# EAGLE design Schematic (EAGLE 9.2.1)
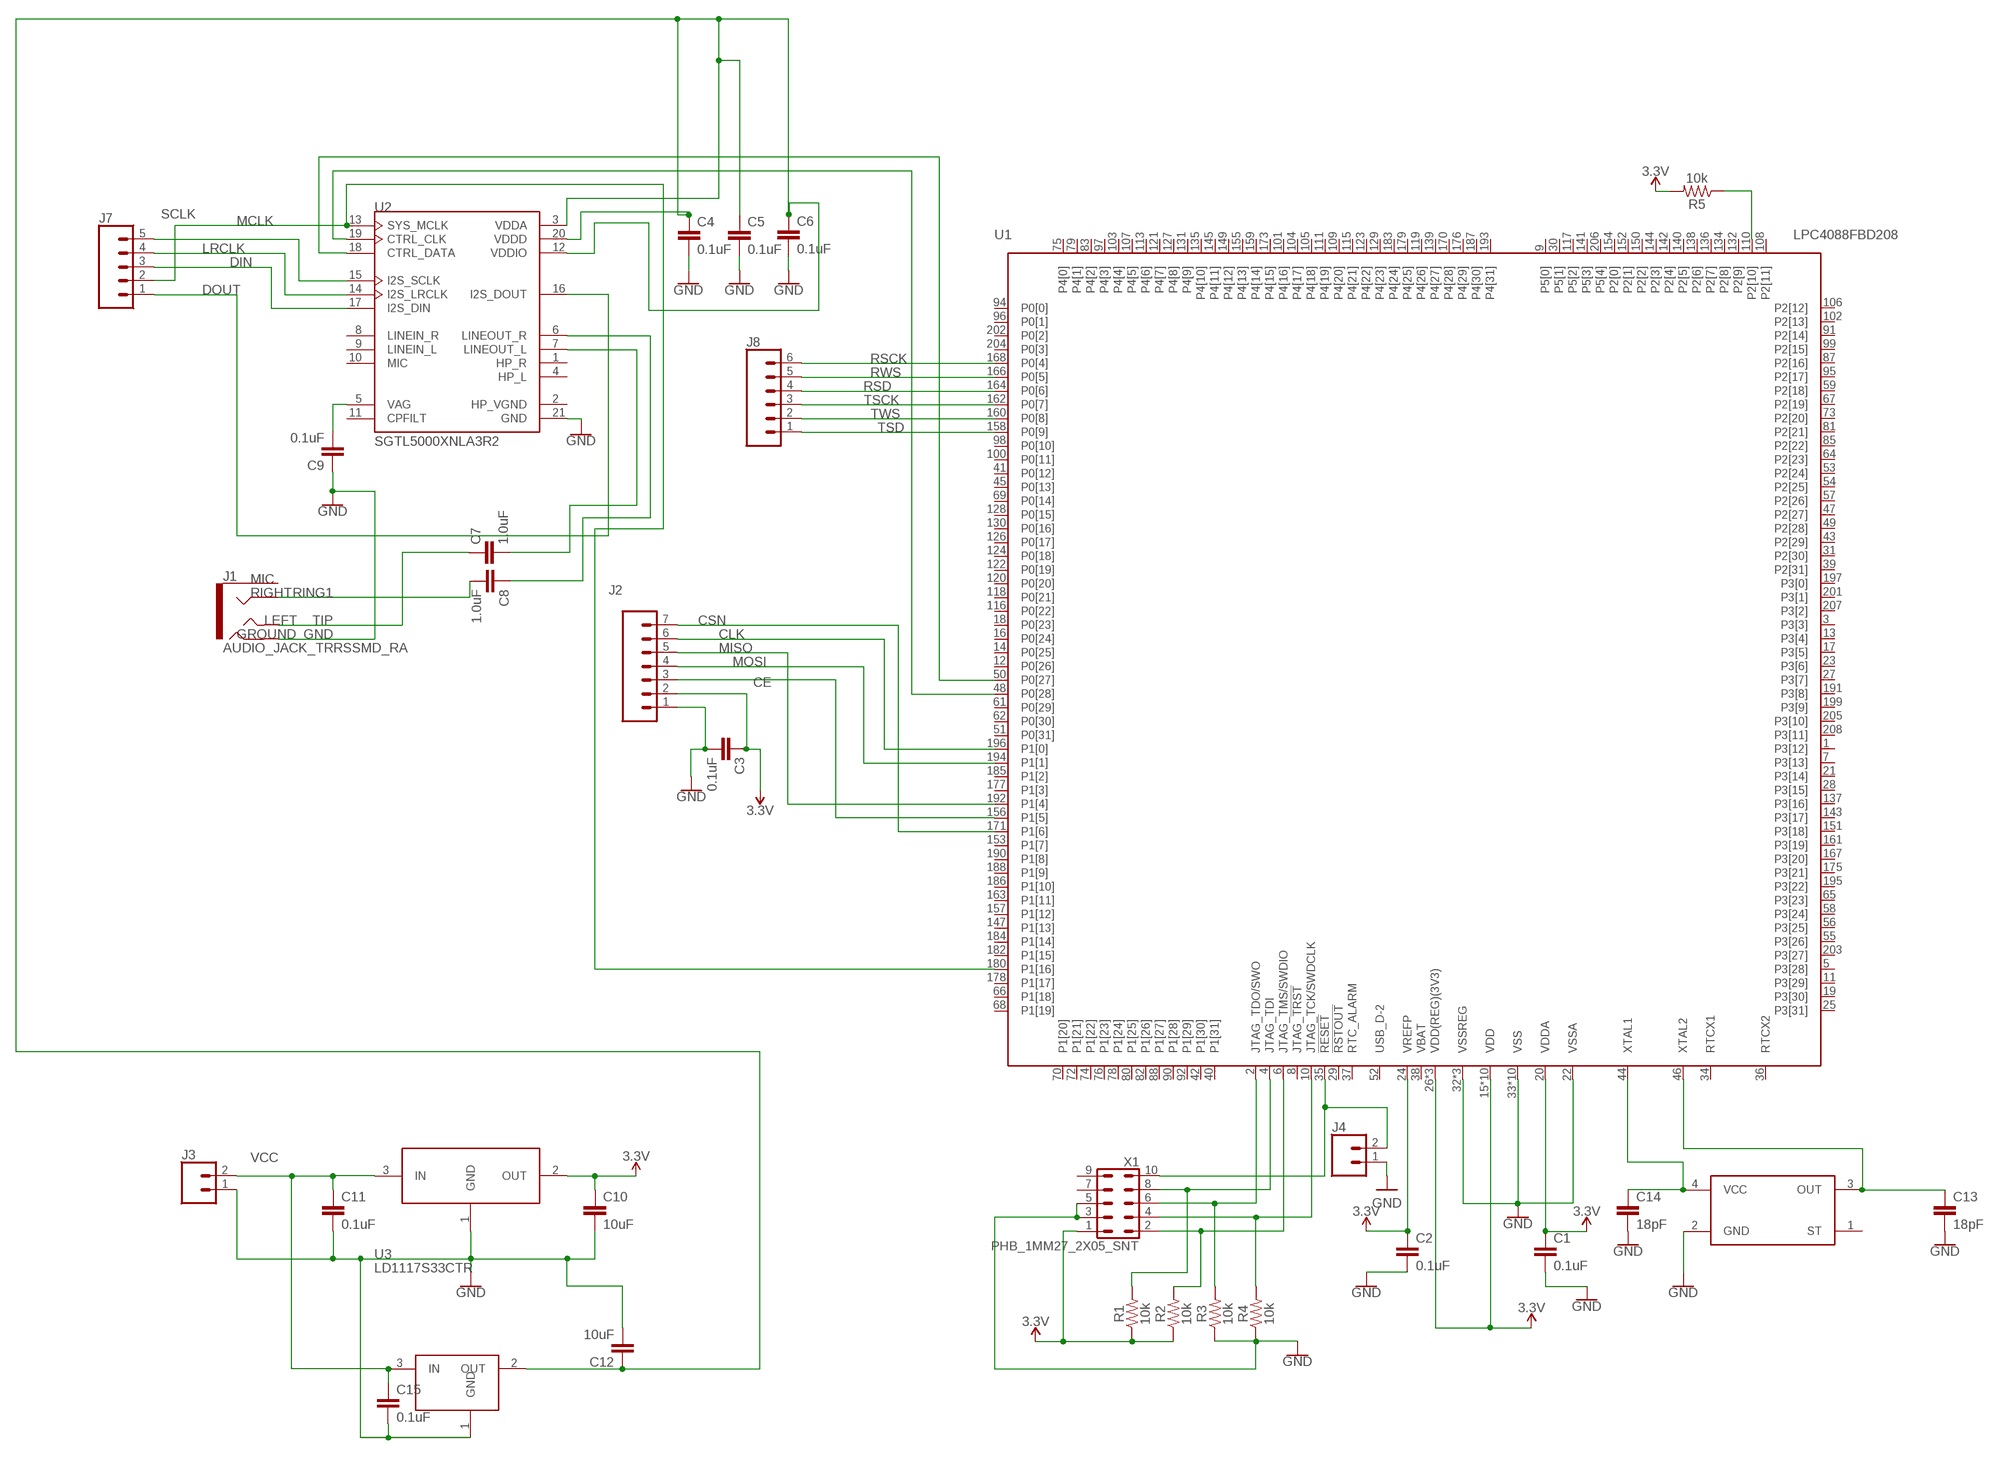
[diagram p0: schematic, sheet 1]

## Parts
C1  0.1uF  0.1UF-0603-25V-(+80/-20%)  [0603]
C2  0.1uF  0.1UF-0603-25V-(+80/-20%)  [0603]
C3  0.1uF  0.1UF-0603-25V-(+80/-20%)  [0603]
C4  0.1uF  0.1UF-0402-16V-10%  [0402]
C5  0.1uF  0.1UF-0402-16V-10%  [0402]
C6  0.1uF  0.1UF-0402-16V-10%  [0402]
C7  1.0uF  1.0UF-0402-16V-10%  [0402]
C8  1.0uF  1.0UF-0402-16V-10%  [0402]
C9  0.1uF  0.1UF-0402-16V-10%  [0402]
C10  10uF  10UF-0603-6.3V-20%  [0603]
C11  0.1uF  0.1UF-0603-25V-(+80/-20%)  [0603]
C12  10uF  10UF-0603-6.3V-20%  [0603]
C13  18pF  18PF-0603-50V-5%  [0603]
C14  18pF  18PF-0603-50V-5%  [0603]
C15  0.1uF  0.1UF-0603-25V-(+80/-20%)  [0603]
J1  AUDIO_JACK_TRRSSMD_RA  [AUDIO_JACK_3.5MM_TRRS_SMD_RA]
J2  CONN_07  [1X07]
J3  CONN_02  [1X02]
J4  CONN_02  [1X02]
J7  CONN_05  [1X05]
J8  CONN_06SILK_FEMALE_PTH  [1X06]
R1  10k  33OHM-0603-1/10W-1%  [0603]
R2  10k  33OHM-0603-1/10W-1%  [0603]
R3  10k  33OHM-0603-1/10W-1%  [0603]
R4  10k  33OHM-0603-1/10W-1%  [0603]
R5  10k  33OHM-0603-1/10W-1%  [0603]
U1  LPC4088FBD208  [SOT459-1]
U2  SGTL5000XNLA3R2  [QFN40P300X300X60-21N]
U3  LD1117S33CTR  [SOT223]
U$1  SOT230P700X180-4N  [SOT230P700X180-4N]
U$2  XTAL_FA-238_25.0000MB-C3  [XTAL_FA-238_25.0000MB-C3]
X1  PHB_1MM27_2X05_SNT  [PHB_1MM27_2X05_SNT]

## Nets
3.3V: C1.1 C2.1 C3.1 C10.1 J2.2 R1.1 R2.1 R5.2 U1.15(VDD) U1.20(VDDA) U1.24(VREFP) U1.26(VDD(REG)(3V3)) U1.60(VDD) U1.71(VDD) U1.86(VDD(REG)(3V3)) U1.89(VDD) U1.112(VDD) U1.125(VDD) U1.146(VDD) U1.165(VDD) U1.174(VDD(REG)(3V3)) U1.181(VDD) U1.198(VDD) U3.2(OUT) X1.1
CE: J2.3 U1.156(P1[5])
CLK: J2.6 U1.196(P1[0])
CSN: J2.7 U1.171(P1[6])
DIN: J7.3 U2.17(I2S_DIN)
DOUT: J7.1 U2.16(I2S_DOUT)
GND: C1.2 C2.2 C3.2 C4.2 C5.2 C6.2 C9.1 C10.2 C11.2 C12.2 C13.2 C14.2 C15.2 J1.RING2 J2.1 J3.1 J4.1 R3.1 R4.1 U1.22(VSSA) U1.32(VSSREG) U1.33(VSS) U1.63(VSS) U1.77(VSS) U1.84(VSSREG) U1.93(VSS) U1.114(VSS) U1.133(VSS) U1.148(VSS) U1.169(VSS) U1.172(VSSREG) U1.189(VSS) U1.200(VSS) U2.21(GND) U3.1(GND) U$1.1(GND) U$2.2(GND) X1.3 X1.5
LRCLK: J7.4 U2.14(I2S_LRCLK)
MCLK: J7.2 U1.180(P1[16]) U2.13(SYS_MCLK)
MISO: J2.5 U1.192(P1[4])
MOSI: J2.4 U1.194(P1[1])
N$1: C8.1 U2.6(LINEOUT_R)
N$2: C7.2 U2.7(LINEOUT_L)
N$3: C14.1 U1.44(XTAL1) U$2.4(VCC)
N$6: U1.48(P0[28]) U2.19(CTRL_CLK)
N$7: U1.50(P0[27]) U2.18(CTRL_DATA)
N$9: R3.2 U1.2(JTAG_TDO/SWO) X1.6
N$12: R1.2 U1.4(JTAG_TDI) X1.8
N$13: R2.2 U1.6(JTAG_TMS/SWDIO) X1.2
N$14: R4.2 U1.10(JTAG_TCK/SWDCLK) X1.4
N$15: C9.2 U2.5(VAG)
N$16: R5.1 U1.110(P2[10])
N$18: J4.2 U1.35(!RESET!) X1.10
N$19: C13.1 U1.46(XTAL2) U$2.3(OUT)
N$20: C4.1 C5.1 C6.1 C12.1 U2.3(VDDA) U2.12(VDDIO) U2.20(VDDD) U$1.2(OUT)
RING1: C8.2 J1.RING1
RSCK: J8.6 U1.168(P0[4])
RSD: J8.4 U1.164(P0[6])
RWS: J8.5 U1.166(P0[5])
SCLK: J7.5 U2.15(I2S_SCLK)
TIP: C7.1 J1.TIP
TSCK: J8.3 U1.162(P0[7])
TSD: J8.1 U1.158(P0[9])
TWS: J8.2 U1.160(P0[8])
VCC: C11.1 C15.1 J3.2 U3.3(IN) U$1.3(IN)
Unconnected: J1.EARTH U1.1(P3[12]) U1.3(P3[3]) U1.5(P3[28]) U1.7(P3[13]) U1.8(JTAG_!TRST) U1.9(P5[0]) U1.11(P3[29]) U1.12(P0[26]) U1.13(P3[4]) U1.14(P0[25]) U1.16(P0[24]) U1.17(P3[5]) U1.18(P0[23]) U1.19(P3[30]) U1.21(P3[14]) U1.23(P3[6]) U1.25(P3[31]) U1.27(P3[7]) U1.28(P3[15]) U1.29(!RSTOUT!) U1.30(P5[1]) U1.31(P2[30]) U1.34(RTCX1) U1.36(RTCX2) U1.37(RTC_ALARM) U1.39(P2[31]) U1.40(P1[31]) U1.41(P0[12]) U1.42(P1[30]) U1.43(P2[29]) U1.45(P0[13]) U1.47(P2[27]) U1.49(P2[28]) U1.51(P0[31]) U1.52(USB_D-2) U1.53(P2[24]) U1.54(P2[25]) U1.55(P3[26]) U1.56(P3[25]) U1.57(P2[26]) U1.58(P3[24]) U1.59(P2[18]) U1.61(P0[29]) U1.62(P0[30]) U1.64(P2[23]) U1.65(P3[23]) U1.66(P1[18]) U1.67(P2[19]) U1.68(P1[19]) U1.69(P0[14]) U1.70(P1[20]) U1.72(P1[21]) U1.73(P2[20]) U1.74(P1[22]) U1.75(P4[0]) U1.76(P1[23]) U1.78(P1[24]) U1.79(P4[1]) U1.80(P1[25]) U1.81(P2[21]) U1.82(P1[26]) U1.83(P4[2]) U1.85(P2[22]) U1.87(P2[16]) U1.88(P1[27]) U1.90(P1[28]) U1.91(P2[14]) U1.92(P1[29]) U1.94(P0[0]) U1.95(P2[17]) U1.96(P0[1]) U1.97(P4[3]) U1.98(P0[10]) U1.99(P2[15]) U1.100(P0[11]) U1.101(P4[16]) U1.102(P2[13]) U1.103(P4[4]) U1.104(P4[17]) U1.105(P4[18]) U1.106(P2[12]) U1.107(P4[5]) U1.108(P2[11]) U1.109(P4[20]) U1.111(P4[19]) U1.113(P4[6]) U1.115(P4[21]) U1.116(P0[22]) U1.117(P5[2]) U1.118(P0[21]) U1.119(P4[26]) U1.120(P0[20]) U1.121(P4[7]) U1.122(P0[19]) U1.123(P4[22]) U1.124(P0[18]) U1.126(P0[17]) U1.127(P4[8]) U1.128(P0[15]) U1.129(P4[23]) U1.130(P0[16]) U1.131(P4[9]) U1.132(P2[9]) U1.134(P2[8]) U1.135(P4[10]) U1.136(P2[7]) U1.137(P3[16]) U1.138(P2[6]) U1.139(P4[27]) U1.140(P2[5]) U1.141(P5[3]) U1.142(P2[4]) U1.143(P3[17]) U1.144(P2[3]) U1.145(P4[11]) U1.147(P1[13]) U1.149(P4[12]) U1.150(P2[2]) U1.151(P3[18]) U1.152(P2[1]) U1.153(P1[7]) U1.154(P2[0]) U1.155(P4[13]) U1.157(P1[12]) U1.159(P4[14]) U1.161(P3[19]) U1.163(P1[11]) U1.167(P3[20]) U1.170(P4[28]) U1.173(P4[15]) U1.175(P3[21]) U1.176(P4[29]) U1.177(P1[3]) U1.178(P1[17]) U1.179(P4[25]) U1.182(P1[15]) U1.183(P4[24]) U1.184(P1[14]) U1.185(P1[2]) U1.186(P1[10]) U1.187(P4[30]) U1.188(P1[9]) U1.190(P1[8]) U1.191(P3[8]) U1.193(P4[31]) U1.195(P3[22]) U1.197(P3[0]) U1.199(P3[9]) U1.201(P3[1]) U1.202(P0[2]) U1.203(P3[27]) U1.204(P0[3]) U1.205(P3[10]) U1.206(P5[4]) U1.207(P3[2]) U1.208(P3[11]) U2.1(HP_R) U2.4(HP_L) U2.8(LINEIN_R) U2.9(LINEIN_L) U2.10(MIC) U2.11(CPFILT) U$2.1(ST) X1.7 X1.9

## Notes on the sheet
- MIC
- RIGHT
- LEFT
- GROUND

## Power pins joined to a net without a drawn wire
HP_VGND: U2.2(HP_VGND)
VBAT: U1.38(VBAT)

## Library data of the parts
C1 C2 C11 C15 = SparkFun-Capacitors:0.1UF: 0.1µF ceramic capacitors A capacitor is a passive two-terminal electrical component used to store electrical energy temporarily in an electric field.; PROD_ID: CAP-00810
C3 = Homework1:0.1UF: 0.1µF ceramic capacitors A capacitor is a passive two-terminal electrical component used to store electrical energy temporarily in an electric field.; PROD_ID: CAP-00810
C4-C6 C9 = Homework1:0.1UF: 0.1µF ceramic capacitors A capacitor is a passive two-terminal electrical component used to store electrical energy temporarily in an electric field.; PROD_ID: CAP-12416
C7 C8 = Homework1:1.0UF: 1µF ceramic capacitors A capacitor is a passive two-terminal electrical component used to store electrical energy temporarily in an electric field.; PROD_ID: CAP-12417
C10 C12 = SparkFun-Capacitors:10UF: 10.0µF ceramic capacitors A capacitor is a passive two-terminal electrical component used to store electrical energy temporarily in an electric field.; PROD_ID: CAP-11015
C13 C14 = SparkFun-Capacitors:18PF: 18pF ceramic capacitors A capacitor is a passive two-terminal electrical component used to store electrical energy temporarily in an electric field.; PROD_ID: CAP-08267
J1 = SparkFun-Connectors:AUDIO_JACK_TRRS: Audio Jack - 3.5mm TRRS (SMD) This is a 3.5mm TRRS SMD audio jack. TRRS connectors are the audio-style connectors that you see on some phones, MP3 players and development boards. TRRS stands for “tip, ring, ring, sleeve,” which reflects that this has three conductors and a ground. SparkFun Products: Audio Jack <https://www.sparkfun.com/products/12639> mbed Starter Kit <https://www.sparkfun.com/products/12968> SparkFun TRRS 3.5mm Jack Breakout <https://www.sparkfun.com/products/11570>; PROD_ID: CONN-10676; SF_ID: PRT-12639
J2 = SparkFun-Connectors:CONN_07: Multi connection point. Often used as Generic Header-pin footprint for 0.1 inch spaced/style header connections On any of the 0.1 inch spaced packages, you can populate with these: Break Away Headers - Straight <https://www.sparkfun.com/products/116> (PRT-00116) Break Away Male Headers - Right Angle <https://www.sparkfun.com/products/553> (PRT-00553) Female Headers <https://www.sparkfun.com/products/115> (PRT-00115) Break Away Headers - Machine Pin <https://www.sparkfun.com/products/117> (PRT-00117) Break Away Female Headers - Swiss Machine Pin <https://www.sparkfun.com/products/743> (PRT-00743) For SCREWTERMINALS and SPRING TERMINALS visit here: Screw Terimnals on SparkFun.com <https://www.sparkfun.com/search/results?term=Screw+Terminals> (5mm/3.5mm/2.54mm spacing) This device is also useful as a general connection point to wire up your design to another part of your project. Our various solder wires solder well into these plated through hole pads. Hook-Up Wire - Assortment (Stranded, 22 AWG) <https://www.sparkfun.com/products/11375> (PRT-11375) Hook-Up Wire - Assortment (Solid Core, 22 AWG) <https://www.sparkfun.com/products/11367> (PRT-11367) View the entire wire category on our website here <https://www.sparkfun.com/categories/141> Special notes: Molex polarized connector foot print use with SKU : PRT-08231 with associated crimp pins and housings. 1MM SMD Version SKU: PRT-10208 NOTES ON THE VARIANTS LOCK and LOCK_LONGPADS... This footprint was designed to help hold the alignment of a through-hole component (i.e. 6-pin header) while soldering it into place. You may notice that each hole has been shifted either up or down by 0.005 of an inch from it's more standard position (which is a perfectly straight line). This slight alteration caused the pins (the squares in the middle) to touch the edges of the holes. Because they are alternating, it causes a "brace" to hold the component in place. 0.005 has proven to be the perfect amount of "off-center" position when using our standard breakaway headers. Although looks a little odd when you look at the bare footprint, once you have a header in there, the alteration is very hard to notice. Also,if you push a header all the way into place, it is covered up entirely on the bottom side.
J3 J4 = SparkFun-Connectors:CONN_02: Multi connection point. Often used as Generic Header-pin footprint for 0.1 inch spaced/style header connections On any of the 0.1 inch spaced packages, you can populate with these: Break Away Headers - Straight <https://www.sparkfun.com/products/116> (PRT-00116) Break Away Male Headers - Right Angle <https://www.sparkfun.com/products/553> (PRT-00553) Female Headers <https://www.sparkfun.com/products/115> (PRT-00115) Break Away Headers - Machine Pin <https://www.sparkfun.com/products/117> (PRT-00117) Break Away Female Headers - Swiss Machine Pin <https://www.sparkfun.com/products/743> (PRT-00743) For SCREWTERMINALS and SPRING TERMINALS visit here: Screw Terimnals on SparkFun.com <https://www.sparkfun.com/search/results?term=Screw+Terminals> (5mm/3.5mm/2.54mm spacing) This device is also useful as a general connection point to wire up your design to another part of your project. Our various solder wires solder well into these plated through hole pads. Hook-Up Wire - Assortment (Stranded, 22 AWG) <https://www.sparkfun.com/products/11375> (PRT-11375) Hook-Up Wire - Assortment (Solid Core, 22 AWG) <https://www.sparkfun.com/products/11367> (PRT-11367) View the entire wire category on our website here <https://www.sparkfun.com/categories/141> Special notes: Molex polarized connector foot print use with: PRT-08233 with associated crimp pins and housings. 2.54_SCREWTERM for use with PRT-10571. 3.5mm Screw Terminal footprints for PRT-08084 5mm Screw Terminal footprints for use with PRT-08432
J7 = SparkFun-Connectors:CONN_05: Multi connection point. Often used as Generic Header-pin footprint for 0.1 inch spaced/style header connections On any of the 0.1 inch spaced packages, you can populate with these: Break Away Headers - Straight <https://www.sparkfun.com/products/116> (PRT-00116) Break Away Male Headers - Right Angle <https://www.sparkfun.com/products/553> (PRT-00553) Female Headers <https://www.sparkfun.com/products/115> (PRT-00115) Break Away Headers - Machine Pin <https://www.sparkfun.com/products/117> (PRT-00117) Break Away Female Headers - Swiss Machine Pin <https://www.sparkfun.com/products/743> (PRT-00743) For SCREWTERMINALS and SPRING TERMINALS visit here: Screw Terimnals on SparkFun.com <https://www.sparkfun.com/search/results?term=Screw+Terminals> (5mm/3.5mm/2.54mm spacing) This device is also useful as a general connection point to wire up your design to another part of your project. Our various solder wires solder well into these plated through hole pads. Hook-Up Wire - Assortment (Stranded, 22 AWG) <https://www.sparkfun.com/products/11375> (PRT-11375) Hook-Up Wire - Assortment (Solid Core, 22 AWG) <https://www.sparkfun.com/products/11367> (PRT-11367) View the entire wire category on our website here <https://www.sparkfun.com/categories/141> Special notes: Molex polarized connector foot print use with SKU : PRT-08231 with associated crimp pins and housings. 1MM SMD Version SKU: PRT-10208
J8 = SparkFun-Connectors:CONN_06: Multi connection point. Often used as Generic Header-pin footprint for 0.1 inch spaced/style header connections On any of the 0.1 inch spaced packages, you can populate with these: Break Away Headers - Straight <https://www.sparkfun.com/products/116> (PRT-00116) Break Away Male Headers - Right Angle <https://www.sparkfun.com/products/553> (PRT-00553) Female Headers <https://www.sparkfun.com/products/115> (PRT-00115) Break Away Headers - Machine Pin <https://www.sparkfun.com/products/117> (PRT-00117) Break Away Female Headers - Swiss Machine Pin <https://www.sparkfun.com/products/743> (PRT-00743) Arduino Stackable Header - 6 Pin <https://www.sparkfun.com/products/9280> (PRT-09280) For SCREWTERMINALS and SPRING TERMINALS visit here: Screw Terimnals on SparkFun.com <https://www.sparkfun.com/search/results?term=Screw+Terminals> (5mm/3.5mm/2.54mm spacing) This device is also useful as a general connection point to wire up your design to another part of your project. Our various solder wires solder well into these plated through hole pads. Hook-Up Wire - Assortment (Stranded, 22 AWG) <https://www.sparkfun.com/products/11375> (PRT-11375) Hook-Up Wire - Assortment (Solid Core, 22 AWG) <https://www.sparkfun.com/products/11367> (PRT-11367) View the entire wire category on our website here <https://www.sparkfun.com/categories/141>; PROD_ID: CONN-08437
R1-R5 = Homework1:33OHM: 33Ω resistor A resistor is a passive two-terminal electrical component that implements electrical resistance as a circuit element. Resistors act to reduce current flow, and, at the same time, act to lower voltage levels within circuits. - Wikipedia; PROD_ID: RES-08270; VALUE: 33
U1 = nxp_60_1_1:LPC4088FBD208: 32-bit ARM Cortex-M4 MCU; up to 512 kB flash, 96 kB SRAM; USB Device/Host/OTG; Ethernet; LCD; EMC; SPIFI The LPC408x/7x is an ARM Cortex-M4 based digital signal controller for embedded applications requiring a high level of integration and low power dissipation. The ARM Cortex-M4 is a next generation core that offers system enhancements such as low power consumption, enhanced debug features, and a high level of support block integration. The ARM Cortex-M4 CPU incorporates a 3-stage pipeline, uses a Harvard architecture with separate local instruction and data buses as well as a third bus for peripherals, and includes an internal prefetch unit that supports speculative branching. The ARM Cortex-M4 supports single-cycle digital signal processing and SIMD instructions. A hardware floating-point processor is integrated in the core for several versions of the part. The LPC408x/7x adds a specialized flash memory accelerator to accomplish optimal performance when executing code from flash. The LPC408x/7x is targeted to operate at up to 120 MHz CPU frequency. The peripheral complement of the LPC408x/7x includes up to 512 kB of flash program memory, up to 96 kB of SRAM data memory, up to 4032 byte of EEPROM data memory, External Memory controller (EMC), LCD, Ethernet, USB Device/Host/OTG, an SPI Flash Interface (SPIFI), a General Purpose DMA controller, five UARTs, three SSP controllers, three I 2 C-bus interfaces, a Quadrature Encoder Interface, four general purpose timers, two general purpose PWMs with six outputs each and one motor control PWM, an ultra-low power RTC with separate battery supply and event recorder, a windowed watchdog timer, a CRC calculation engine and up to 165 general purpose I/O pins. The analog peripherals include one eight-channel 12-bit ADC, two analog comparators, and a DAC. The pinout of LPC408x/7x is intended to allow pin function compatibility with the LPC24xx/23xx as well as the LPC178x/7x families. AAL Eindhoven MK
U2 = SGTL5000XNLA3R2:SGTL5000XNLA3R2: Audio Codec , Ultra Low-Power, 4 mw for DAC-to-HP, 98 dB SNR and -80 dB THD+N, QFN 20, Reel; AVAILABILITY: Unavailable; DESCRIPTION: Audio Codec , Ultra Low-Power, 4 mw for DAC-to-HP, 98 dB SNR and -80 dB THD+N, QFN 32, Reel; MF: NXP USA; MP: SGTL5000XNLA3R2; PACKAGE: QFN-20 Freescale Semiconductor; PRICE: None
U3 = LD1117S33CTR:LD1117S33CTR: http://octopart.com/ld1117s33tr-stmicroelectronics-526708; AVAILABILITY: Unavailable; DESCRIPTION: LD1117 Series 1300 mA 3.3 V Fixed Output Positive Voltage LDO Regulator- SOT-223; MF: STMicroelectronics; MP: LD1117S33CTR; PACKAGE: SOT-223 STMicroelectronics; PRICE: None
U$1 = SOT230P700X180-4N:SOT230P700X180-4N
U$2 = XTAL_FA-238_25.0000MB-C3:XTAL_FA-238_25.0000MB-C3
X1 = _hhn_con_pinhead_box_1mm27:PHB_1MM27_2X05_*: Pin Header Box-Type, 1.27mm/0.5"/50mil Pitch, 2x05 Circuits Note: see library description for an important note about THT-version

## Board
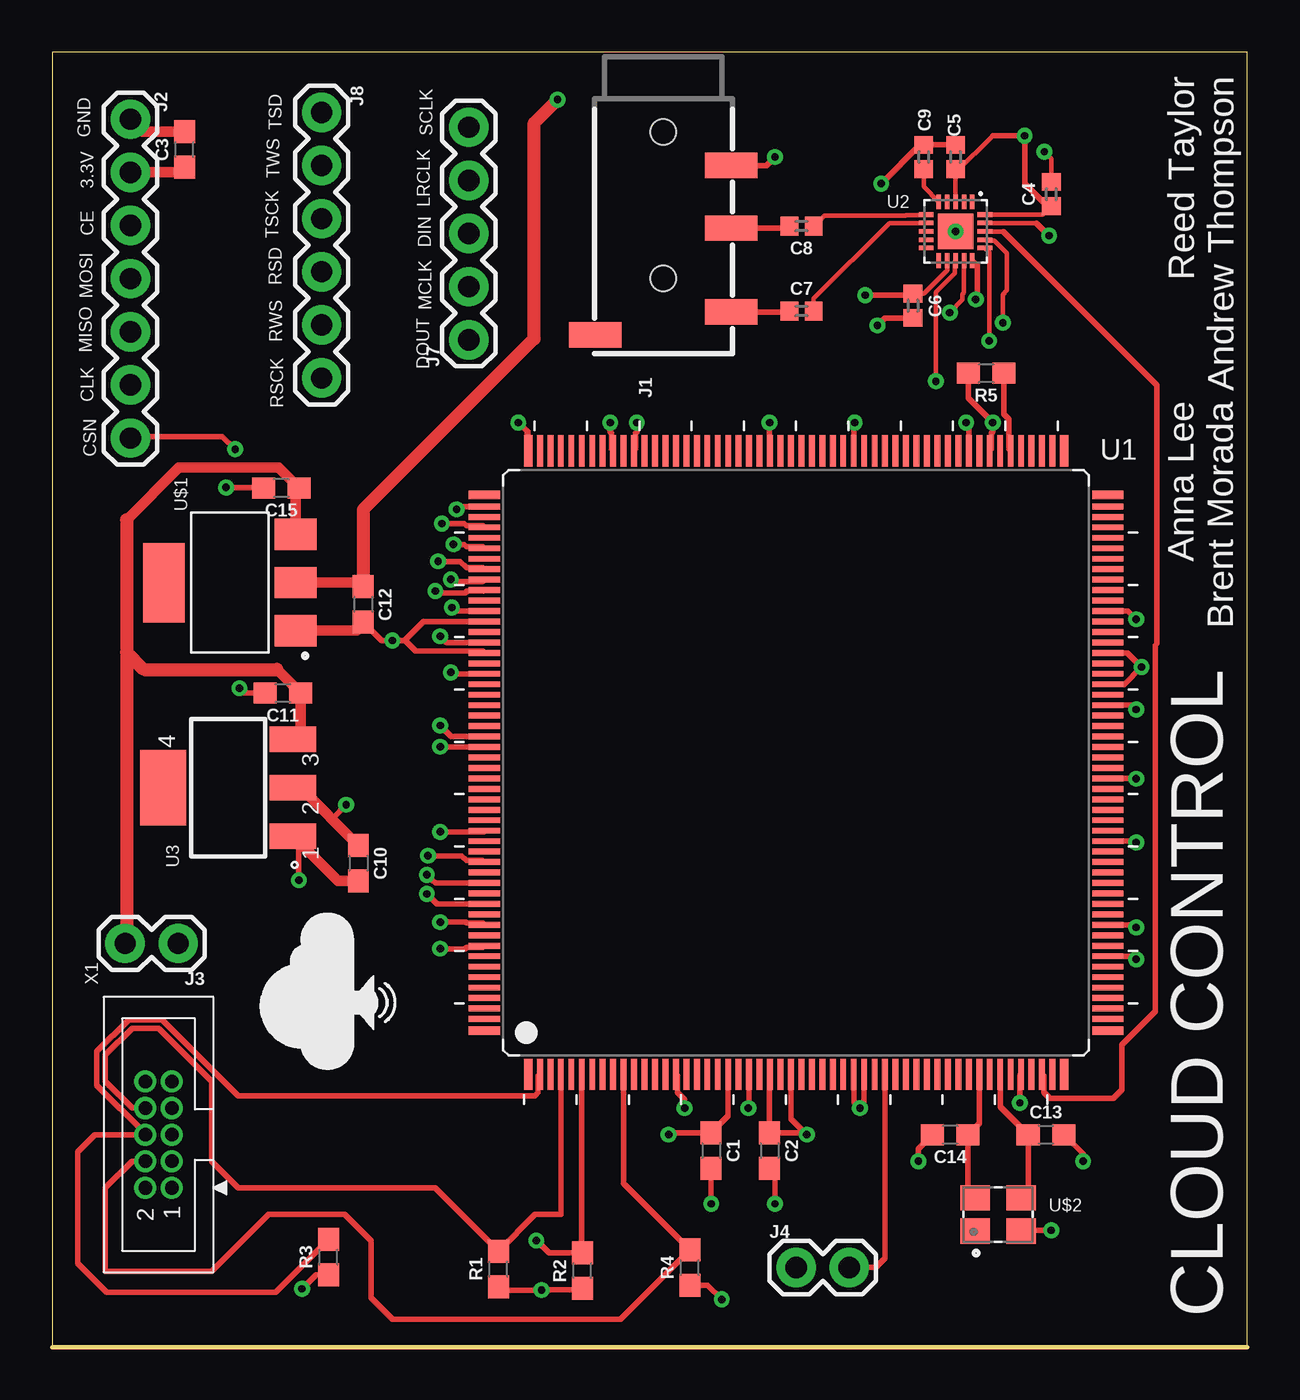
[diagram p1: board, top side]
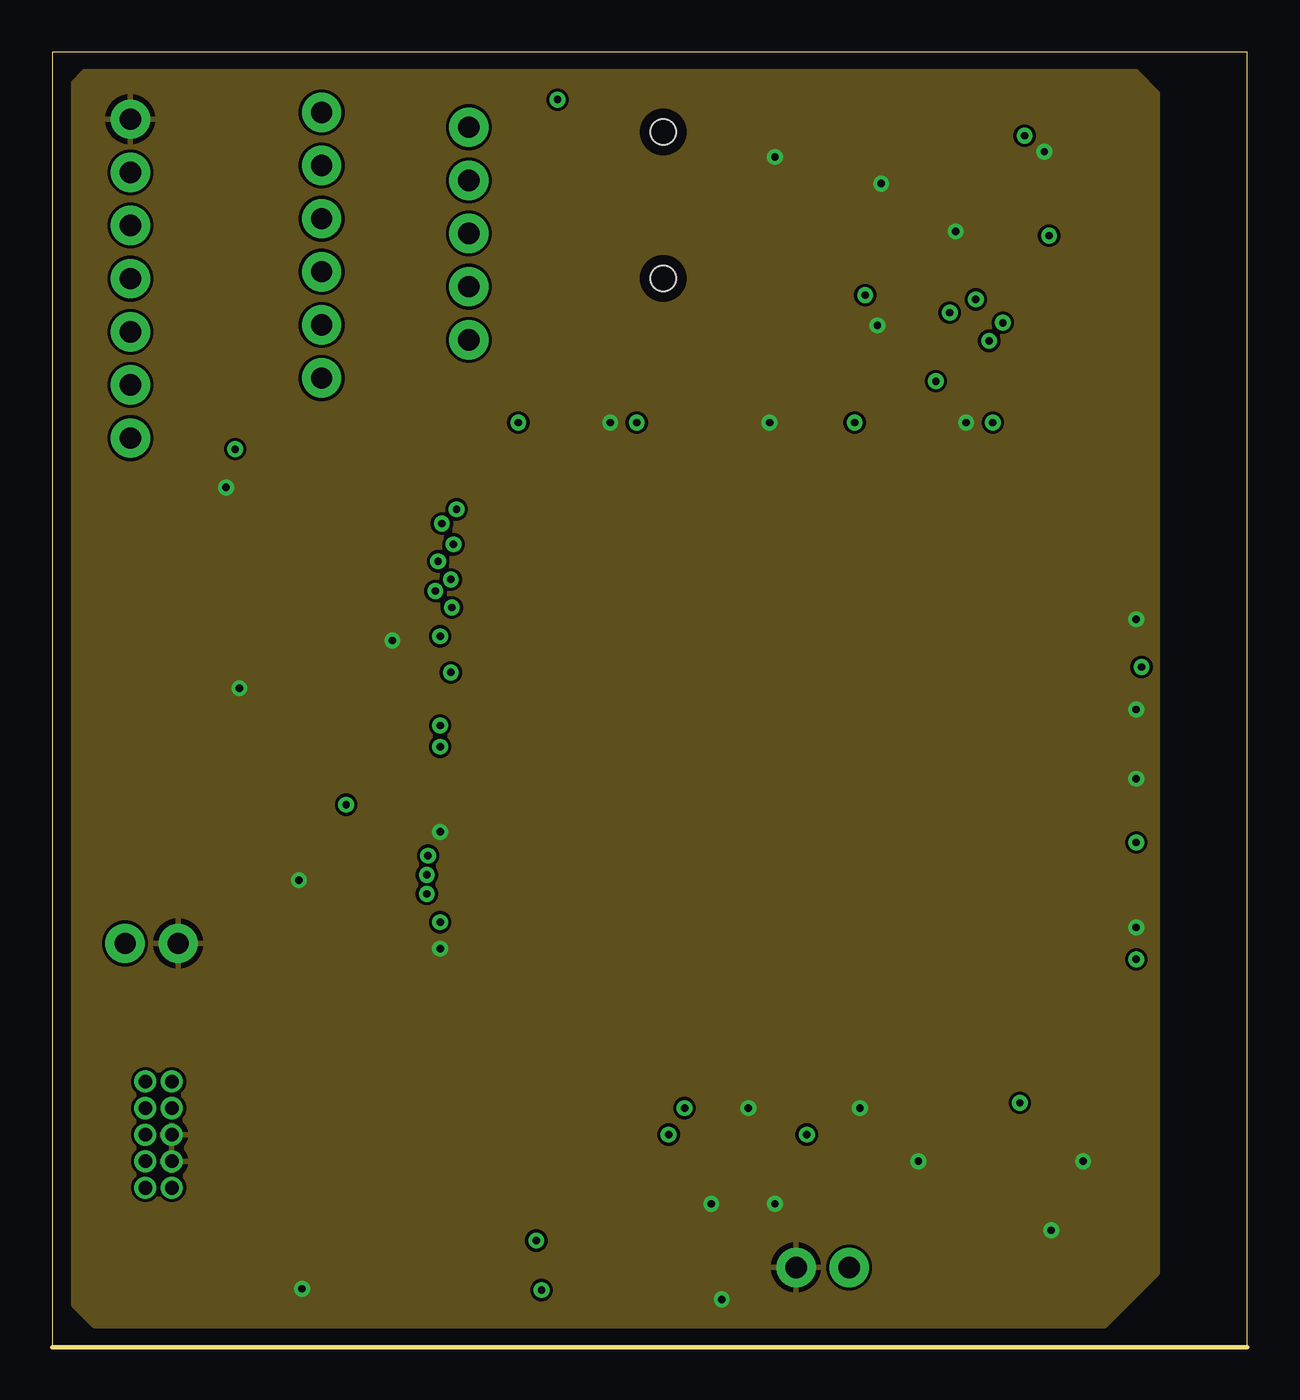
[diagram p2: board, inner layer Route2]
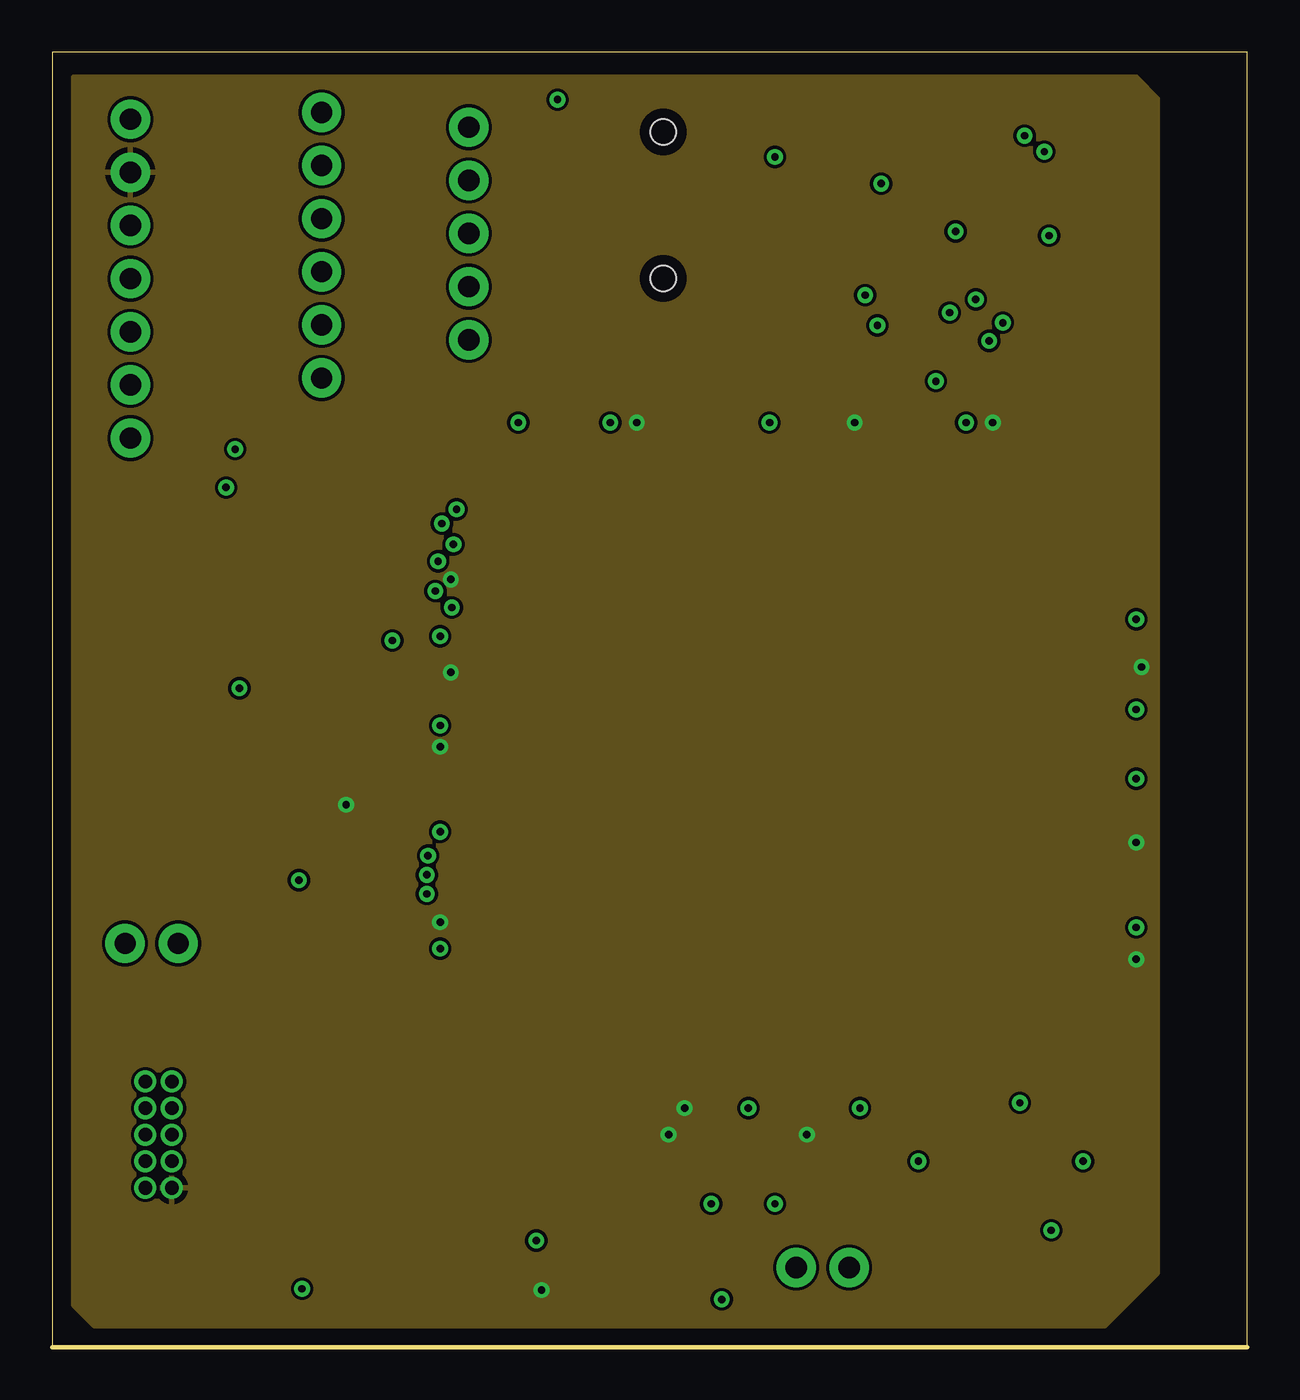
[diagram p3: board, inner layer Route15]
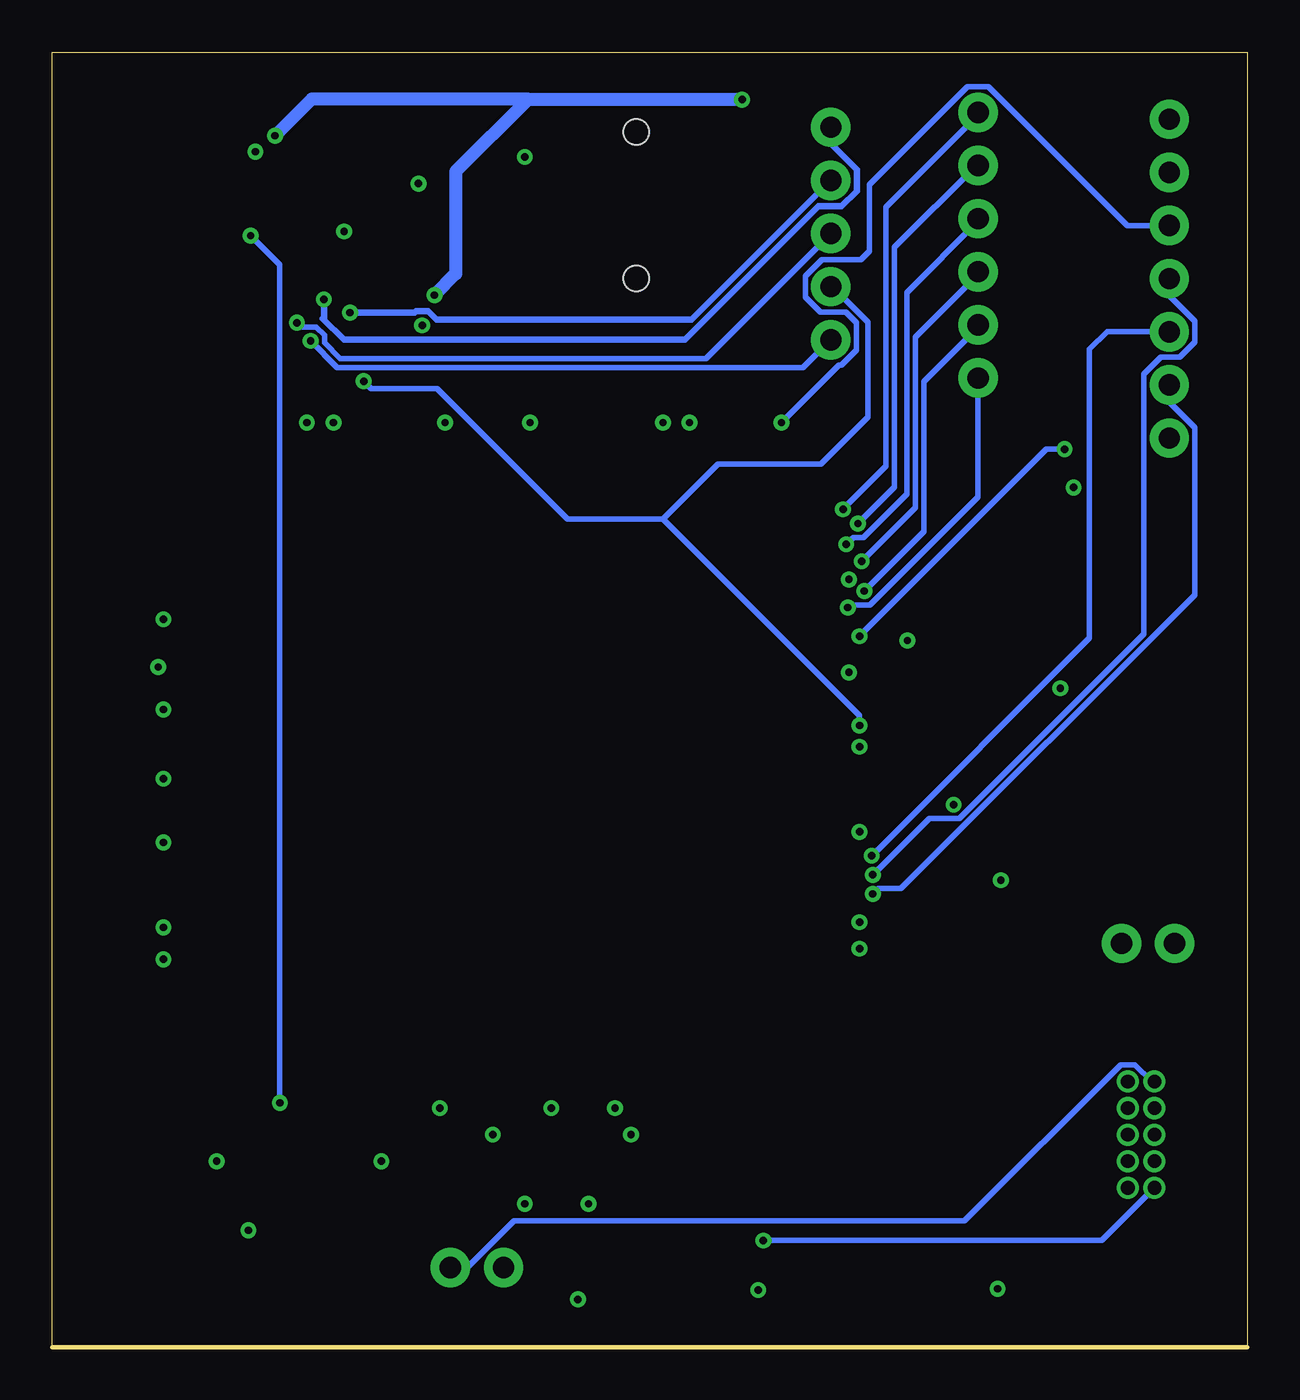
[diagram p4: board, bottom side, seen from below]

Size 57.13 x 61.9 mm. Coordinates in mm from the lower left corner, seen from the top.
Outline: 0,0 57.13,0 57.13,61.9 0,61.9 0,0
Copper layers (1+2*15+16): Top 0.0178mm / dielectric 12mil / Route2 0.0356mm / dielectric 28mil / Route15 0.0356mm / dielectric 12mil / Bottom 0.0178mm
Design rules "SSC-EAGLE-4Lyr_v1.0.0.3 *": minimum track width 6mil, minimum drill 8mil, track to track 6mil, track to pad 6mil, pad to pad 6mil, via to via 6mil, smd to smd 6mil, copper to edge 20mil, drill to drill 16mil, minimum pad ring 8mil, minimum via ring 8mil, stop-mask expansion 3mil, vias tented up to drill 0mil, thermal gap 10mil

### Footprints (pad centres in the part's own frame; a part is rotated, then mirrored left to right if it is on the bottom)
0603 = smd 1.1 x 1: 1 -0.85,0; 2 0.85,0
0402 = smd 0.85 x 0.9: 1 -0.58,0; 2 0.58,0
AUDIO_JACK_3.5MM_TRRS_SMD_RA = smd 1.2 x 2.5: EARTH 11.3,-3.25; RING1 6.2,3.25; RING2 3.2,3.25; TIP 10.2,3.25 | hole 1.2: 1.6,0; 8.6,0
1X07 = drill 1.016 pad 1.88: 1 0,0; 2 2.54,0; 3 5.08,0; 4 7.62,0; 5 10.16,0; 6 12.7,0; 7 15.24,0
1X02 = drill 1.016 pad 1.88: 1 0,0; 2 2.54,0
1X05 = drill 1.016 pad 1.88: 1 0,0; 2 2.54,0; 3 5.08,0; 4 7.62,0; 5 10.16,0
1X06 = drill 1.016 pad 1.88: 1 0,0; 2 2.54,0; 3 5.08,0; 4 7.62,0; 5 10.16,0; 6 12.7,0
SOT459-1 = smd 0.4 x 1.5: 1 -12.81,-14.9; 52 12.81,-14.9; 105 12.81,14.9; 156 -12.81,14.9 | smd 0.28 x 1.5: 2 -12.25,-14.9; 3 -11.75,-14.9; 4 -11.25,-14.9; 5 -10.75,-14.9; 6 -10.25,-14.9; 7 -9.75,-14.9; 8 -9.25,-14.9; 9 -8.75,-14.9; 10 -8.25,-14.9; 11 -7.75,-14.9; 12 -7.25,-14.9; 13 -6.75,-14.9; 14 -6.25,-14.9; 15 -5.75,-14.9; 16 -5.25,-14.9; 17 -4.75,-14.9; 18 -4.25,-14.9; 19 -3.75,-14.9; 20 -3.25,-14.9; 21 -2.75,-14.9; 22 -2.25,-14.9; 23 -1.75,-14.9; 24 -1.25,-14.9; 25 -0.75,-14.9; 26 -0.25,-14.9; 27 0.25,-14.9; 28 0.75,-14.9; 29 1.25,-14.9; 30 1.75,-14.9; 31 2.25,-14.9; 32 2.75,-14.9; 33 3.25,-14.9; 34 3.75,-14.9; 35 4.25,-14.9; 36 4.75,-14.9; 37 5.25,-14.9; 38 5.75,-14.9; 39 6.25,-14.9; 40 6.75,-14.9; 41 7.25,-14.9; 42 7.75,-14.9; 43 8.25,-14.9; 44 8.75,-14.9; 45 9.25,-14.9; 46 9.75,-14.9; 47 10.25,-14.9; 48 10.75,-14.9; 49 11.25,-14.9; 50 11.75,-14.9; 51 12.25,-14.9; 106 12.25,14.9; 107 11.75,14.9; 108 11.25,14.9; 109 10.75,14.9; 110 10.25,14.9; 111 9.75,14.9; 112 9.25,14.9; 113 8.75,14.9; 114 8.25,14.9; 115 7.75,14.9; 116 7.25,14.9; 117 6.75,14.9; 118 6.25,14.9; 119 5.75,14.9; 120 5.25,14.9; 121 4.75,14.9; 122 4.25,14.9; 123 3.75,14.9; 124 3.25,14.9; 125 2.75,14.9; 126 2.25,14.9; 127 1.75,14.9; 128 1.25,14.9; 129 0.75,14.9; 130 0.25,14.9; 131 -0.25,14.9; 132 -0.75,14.9; 133 -1.25,14.9; 134 -1.75,14.9; 135 -2.25,14.9; 136 -2.75,14.9; 137 -3.25,14.9; 138 -3.75,14.9; 139 -4.25,14.9; 140 -4.75,14.9; 141 -5.25,14.9; 142 -5.75,14.9; 143 -6.25,14.9; 144 -6.75,14.9; 145 -7.25,14.9; 146 -7.75,14.9; 147 -8.25,14.9; 148 -8.75,14.9; 149 -9.25,14.9; 150 -9.75,14.9; 151 -10.25,14.9; 152 -10.75,14.9; 153 -11.25,14.9; 154 -11.75,14.9; 155 -12.25,14.9 | smd 1.5 x 0.4: 53 14.9,-12.81; 104 14.9,12.81; 157 -14.9,12.81; 208 -14.9,-12.81 | smd 1.5 x 0.28: 54 14.9,-12.25; 55 14.9,-11.75; 56 14.9,-11.25; 57 14.9,-10.75; 58 14.9,-10.25; 59 14.9,-9.75; 60 14.9,-9.25; 61 14.9,-8.75; 62 14.9,-8.25; 63 14.9,-7.75; 64 14.9,-7.25; 65 14.9,-6.75; 66 14.9,-6.25; 67 14.9,-5.75; 68 14.9,-5.25; 69 14.9,-4.75; 70 14.9,-4.25; 71 14.9,-3.75; 72 14.9,-3.25; 73 14.9,-2.75; 74 14.9,-2.25; 75 14.9,-1.75; 76 14.9,-1.25; 77 14.9,-0.75; 78 14.9,-0.25; 79 14.9,0.25; 80 14.9,0.75; 81 14.9,1.25; 82 14.9,1.75; 83 14.9,2.25; 84 14.9,2.75; 85 14.9,3.25; 86 14.9,3.75; 87 14.9,4.25; 88 14.9,4.75; 89 14.9,5.25; 90 14.9,5.75; 91 14.9,6.25; 92 14.9,6.75; 93 14.9,7.25; 94 14.9,7.75; 95 14.9,8.25; 96 14.9,8.75; 97 14.9,9.25; 98 14.9,9.75; 99 14.9,10.25; 100 14.9,10.75; 101 14.9,11.25; 102 14.9,11.75; 103 14.9,12.25; 158 -14.9,12.25; 159 -14.9,11.75; 160 -14.9,11.25; 161 -14.9,10.75; 162 -14.9,10.25; 163 -14.9,9.75; 164 -14.9,9.25; 165 -14.9,8.75; 166 -14.9,8.25; 167 -14.9,7.75; 168 -14.9,7.25; 169 -14.9,6.75; 170 -14.9,6.25; 171 -14.9,5.75; 172 -14.9,5.25; 173 -14.9,4.75; 174 -14.9,4.25; 175 -14.9,3.75; 176 -14.9,3.25; 177 -14.9,2.75; 178 -14.9,2.25; 179 -14.9,1.75; 180 -14.9,1.25; 181 -14.9,0.75; 182 -14.9,0.25; 183 -14.9,-0.25; 184 -14.9,-0.75; 185 -14.9,-1.25; 186 -14.9,-1.75; 187 -14.9,-2.25; 188 -14.9,-2.75; 189 -14.9,-3.25; 190 -14.9,-3.75; 191 -14.9,-4.25; 192 -14.9,-4.75; 193 -14.9,-5.25; 194 -14.9,-5.75; 195 -14.9,-6.25; 196 -14.9,-6.75; 197 -14.9,-7.25; 198 -14.9,-7.75; 199 -14.9,-8.25; 200 -14.9,-8.75; 201 -14.9,-9.25; 202 -14.9,-9.75; 203 -14.9,-10.25; 204 -14.9,-10.75; 205 -14.9,-11.25; 206 -14.9,-11.75; 207 -14.9,-12.25
QFN40P300X300X60-21N = smd 0.71 x 0.22: 1 -1.405,0.8; 2 -1.405,0.4; 3 -1.405,0; 4 -1.405,-0.4; 5 -1.405,-0.8; 11 1.405,-0.8; 12 1.405,-0.4; 13 1.405,0; 14 1.405,0.4; 15 1.405,0.8 | smd 0.22 x 0.71: 6 -0.8,-1.405; 7 -0.4,-1.405; 8 0,-1.405; 9 0.4,-1.405; 10 0.8,-1.405; 16 0.8,1.405; 17 0.4,1.405; 18 0,1.405; 19 -0.4,1.405; 20 -0.8,1.405 | smd 1.7 x 1.7: 21 0,0
SOT223 = smd 2.235 x 1.219: 1 -3.099,2.311; 2 -3.099,0; 3 -3.099,-2.311 | smd 2.2 x 3.6: 4 3.099,0
SOT230P700X180-4N = smd 1.5 x 2: 1 -2.3,-3.15; 2 0,-3.15; 3 2.3,-3.15 | smd 3.8 x 2: 4 0,3.15
XTAL_FA-238_25.0000MB-C3 = smd 1.2 x 1.4: 1 -0.8,1.1; 2 -0.8,-1.1; 3 0.8,-1.1; 4 0.8,1.1
PHB_1MM27_2X05_SNT = drill 0.65: 1 -2.54,-0.635; 2 -2.54,0.635; 3 -1.27,-0.635; 4 -1.27,0.635; 5 0,-0.635; 6 0,0.635; 7 1.27,-0.635; 8 1.27,0.635; 9 2.54,-0.635; 10 2.54,0.635

### Placement (x,y rotation side)
C1  31.5,9.4 270 top
C2  34.29,9.4 270 top
C3  6.32,57.25 90 top
C4  47.75,55.12 90 top
C5  43.18,56.9 90 top
C6  41.15,49.78 270 top
C7  35.81,49.53 0 top
C8  35.81,53.59 180 top
C9  41.66,56.9 270 top
C10  14.63,23.14 270 top
C11  11.02,31.27 180 top
C12  14.86,35.51 270 top
C13  47.5,10.16 0 top
C14  42.93,10.16 180 top
C15  10.95,41.07 180 top
J1  29.21,59.69 270 top
J2  3.73,58.7 270 top
J3  6.02,19.3 180 top
J4  35.56,3.81 0 top
J7  19.91,48.16 90 top
J8  12.88,59.03 270 top
R1  21.33,3.75 90 top
R2  25.34,3.66 90 top
R3  13.21,4.32 90 top
R4  30.48,3.81 90 top
R5  44.64,46.56 180 top
U1  35.56,27.94 0 top
U2  43.18,53.34 270 top
U3  8.41,26.75 180 top
U$1  8.48,36.55 90 top
U$2  45.21,6.35 90 top
X1  5.08,10.16 90 top

### Tracks (layer width: path | path; a pad name or v marks a point on that pad's centre or on a via)
3.3V  (via drill 0.35)
  Top 0.254: U1.20 32.31,11.06 C1.1 29.55,10.25 v29.46,10.16 | C10.1 13.33,25.29 13.39,25.35 13.46,25.35 v14.05,25.93 | U1.26 35.31,10.92 v36.07,10.16 35.98,10.25 C2.1 34.29,13.02 U1.24 | U1.15 29.89,12.96 29.89,12.17 30.23,11.84 v30.23,11.43 | v18.54,28.7 20.65,28.7 U1.181 | v18.54,20.32 19.74,20.32 19.79,20.27 20.58,20.27 U1.198 | v19.05,36.7 19.14,36.61 20.58,36.61 U1.165 | v19.05,32.26 19.12,32.19 U1.174 | U1.112 44.89,42.92 44.89,43.71 44.96,43.77 v44.96,44.2 43.79,45.36 R5.2 | v27.94,44.2 27.94,43.76 27.89,43.71 27.89,42.92 U1.146 | U1.60 51.67,18.69 v51.82,18.54 | U1.71 51.76,24.19 v51.82,24.13 | U1.89 51.39,33.19 v52.07,32.51 51.25,31.69 U1.86 | U1.125 38.31,44.15 v38.35,44.2 | R1.1 21.5,2.73 v23.39,2.73 23.41,2.75 25.28,2.75 R2.1
  Top 0.508: C10.1 11.87,26.75 U3.2 | J2.2 6.08,56.16 C3.1
  pour Route15: 1.02,60.71 1.02,2.03 2.03,1.02 50.29,1.02 52.83,3.56 52.83,59.69 51.82,60.71
CE  (via drill 0.35)
  Top 0.254: v22.28,44.2 22.71,43.76
  Top 0.305: 22.71,43.76 22.71,42.88 U1.156
  Bottom 0.254: v22.28,44.2 19.53,46.94 19.41,46.94 18.69,47.65 18.69,48.98 19.19,49.48 20.42,49.48 21.13,50.19 21.13,51.2 20.34,51.99 18.47,51.99 18.06,52.4 18.06,55.57 13.38,60.25 12.37,60.25 5.74,53.62 J2.3
CLK  (via drill 0.35)
  Top 0.254: v17.91,21.67 18.38,21.19 U1.196
  Bottom 0.254: v17.91,21.67 17.65,21.92 16.55,21.92 2.51,35.96 2.51,43.96 3.73,45.18 J2.6
CSN  (via drill 0.35)
  Top 0.254: J2.7 3.81,43.54 8.13,43.54 v8.74,42.93 | v18.54,33.99 18.84,33.69 U1.171
  Bottom 0.254: v18.54,33.99 9.6,42.93 v8.74,42.93
DIN  (via drill 0.35)
  Top 0.203: U2.17 44.62,52.9 45.05,52.9 45.64,52.3 45.64,50.52 45.44,50.32 v45.44,48.97
  Bottom 0.254: v45.44,48.97 45.23,48.77 44.51,48.77 44.12,48.38 44.12,48.02 43.36,47.27 25.89,47.27 J7.3
DOUT  (via drill 0.35)
  Top 0.203: U2.16 44.79,52.34 v44.79,48.12 v44.78,48.11
  Bottom 0.254: v44.78,48.11 43.51,46.84 21.23,46.84 J7.1
GND  (via drill 0.35)
  Top 0.152: U3.1 11.79,24.16
  Top 0.203: 41.47,57.48 C9.1 | C4.2 47.75,56.81 v47.42,57.15
  Top 0.254: 14.55,34.25 14.86,34.56 C12.2 15.74,33.78 v16.26,33.78 16.83,33.78 | C11.2 9.17,31.27 v8.94,31.5 | C15.2 9.93,41.07 9.91,41.1 v8.31,41.1 | v31.5,6.86 C1.2 | v34.54,6.86 34.54,8.29 C2.2 | v32,2.29 31.33,2.96 R4.1 | R3.1 12.61,3.47 v11.94,2.79 | v41.4,8.89 41.4,9.49 C14.2 | v47.75,5.59 46.35,5.59 U$2.2 | v49.28,8.89 49.28,9.23 C13.2 | U1.32 38.31,11.73 v38.61,11.43 38.81,11.63 U1.33 | v33.27,11.43 33.31,11.47 U1.22 | v18.54,24.64 20.61,24.64 U1.189 | v18.54,19.05 19.73,19.05 19.79,19.11 20.58,19.11 U1.200 | U1.172 20.58,33.27 17.38,33.27 16.87,33.78 16.83,33.78 | 16.83,33.78 17.74,34.69 U1.169 | v39.62,55.63 41.47,57.48 | C9.1 C5.2 | C6.2 39.81,49.2 v39.45,48.84 | v43.69,44.2 43.81,44.07 U1.114 | v26.67,44.2 26.67,43.77 26.73,43.71 26.73,42.92 U1.148 | v34.29,44.2 34.29,42.86 U1.133 | U1.63 51.69,20.19 v51.82,20.07 | U1.77 51.8,27.19 v51.82,27.18 | U1.84 51.61,30.69 v51.82,30.48 | U1.93 51.42,35.19 v51.82,34.8 | J1.RING2 34.14,56.49 v34.54,56.9 | 11.79,24.16 v11.79,22.33
  Top 0.508: U$1.1 14.55,34.25 | U3.1 13.65,22.29 C10.2 | J2.1 4.33,58.1 C3.2
  other vias: 43.18,53.34
  pour Route2: 1.02,60.45 1.02,2.03 2.03,1.02 50.29,1.02 52.83,3.56 52.83,59.94 51.82,60.96 1.52,60.96
LRCLK  (via drill 0.35)
  Top 0.203: U2.14 43.58,50.42 43.51,50.35 43.51,50.07 v42.9,49.45
  Bottom 0.305: J7.4 26.57,49.12 38.76,49.12 39.16,49.53 39.73,49.53 39.8,49.45 v42.9,49.45
MCLK  (via drill 0.35)
  Top 0.203: U2.13 43.14,51.9 43.14,51.35 42.24,50.45 v42.24,46.18
  Top 0.254: v18.54,29.72 19.07,29.19 U1.180
  Bottom 0.254: v42.24,46.18 41.89,45.82 38.73,45.82 32.5,39.6 27.94,39.6 | 27.94,39.6 18.54,30.2 v18.54,29.72 | 27.94,39.6 25.32,42.22 20.38,42.22 18.14,44.46 18.14,49 19.83,50.7 J7.2
MISO  (via drill 0.35)
  Top 0.254: U1.192 20.58,23.27 19.79,23.27 19.57,23.49 v17.96,23.49
  Bottom 0.254: v17.96,23.49 7.54,33.91 7.54,47.7 6.71,48.54 J2.5
MOSI  (via drill 0.35)
  Top 0.254: v17.91,22.58 18.16,22.32 18.18,22.32 18.31,22.19 U1.194
  Bottom 0.254: v17.91,22.58 15.21,25.28 13.77,25.28 4.95,34.1 4.95,46.5 4.14,47.32 3.23,47.32 2.51,48.03 2.51,49.04 3.73,50.26 J2.4
N$1
  Top 0.203: U2.6 41.74,54.1 40.81,54.1 40.8,54.1 36.9,54.1 C8.1
N$2
  Top 0.203: C7.2 36.39,50.12 40.02,53.74 U2.7
N$3
  Top 0.254: U$2.4 44.14,7.17 43.78,7.53 C14.1 44.31,10.69 U1.44
N$6  (via drill 0.35)
  Top 0.203: U2.19 47.05,53.74
  Top 0.254: U1.48 46.25,12.98 v46.25,11.68 | 47.05,53.74 v47.65,53.14
  Bottom 0.254: v46.25,11.68 46.25,51.74 v47.65,53.14
N$7
  Top 0.203: 45.46,53.33 44.6,53.33 U2.18
  Top 0.254: U1.50 47.39,12.96 47.39,12.17 47.68,11.89 50.72,11.89 51.13,12.29 51.13,14.45 52.73,16.05 52.73,33.55 52.81,33.63 52.81,45.99 45.46,53.33
N$9
  Top 0.254: R3.2 10.67,2.63 2.6,2.63 1.22,4.01 1.22,9.35 2.03,10.16 X1.6 4.44,10.22 2.13,12.53 2.13,14.14 3.64,15.65 5.25,15.65 8.88,12.01 23.07,12.01 23.23,12.17 23.23,12.96 U1.2
N$12
  Top 0.254: U1.4 24.31,6.35 23.09,6.35 R1.2 18.31,7.62 8.89,7.62 7.62,8.89 7.62,12.7 5.08,15.24 3.81,15.24 2.54,13.97 2.54,12.7 3.81,11.43 X1.8
N$13  (via drill 0.35)
  Top 0.254: U1.6 25.31,4.54 R2.2 23.73,4.51 v23.14,5.1
  Bottom 0.254: v23.14,5.1 6.96,5.1 X1.2
N$14
  Top 0.254: U1.10 27.31,7.83 R4.2 27.17,1.35 16.26,1.35 15.24,2.36 15.24,5.08 13.97,6.35 10.34,6.35 7.62,3.63 2.54,3.63 2.54,7.62 3.81,8.89 X1.4
N$15
  Top 0.203: C9.2 41.66,55.47 U2.5
N$16
  Top 0.254: R5.1 45.49,44.59 45.73,44.35 45.73,42.92 U1.110
N$18
  Top 0.254: J4.2 39.37,3.81 39.81,4.25 U1.35
  Bottom 0.254: J4.2 37.28,3.81 35.06,6.04 13.52,6.04 6.05,13.51 5.38,13.51 4.57,12.7 X1.10
N$19
  Top 0.254: U1.46 45.31,11.5 C13.1 46.65,7.49 U$2.3
N$20  (via drill 0.35)
  Top 0.203: U2.20 47.35,54.14 47.66,54.45 C4.1 | C5.1 43.18,56.13 | 43.18,56.13 U2.3 | U2.12 42.78,51.49 41.66,50.36 C6.1 | 44.96,57.91 43.18,56.13
  Top 0.254: v38.86,50.29 41.08,50.29 C6.1 | 47.66,54.45 46.48,55.63 v46.48,57.91 44.96,57.91
  Top 0.508: 14.86,36.55 U$1.2
  Top 0.61: 14.86,36.55 C12.1 14.86,40.03 23.03,48.21 23.03,58.52 v24.15,59.64
  Bottom 0.61: v46.48,57.91 44.73,59.66 34.39,59.66 34.42,59.64 | v38.86,50.29 37.85,51.31 37.85,56.21 34.42,59.64 | v24.15,59.64 34.42,59.64
RING1
  Top 0.254: J1.RING1 35.13,53.49 C8.2
RSCK  (via drill 0.35)
  Top 0.254: v19.1,35.36 19.27,35.19 U1.168
  Bottom 0.254: v19.1,35.36 18.97,35.49 18.04,35.49 12.88,40.65 J8.6
RSD  (via drill 0.35)
  Top 0.254: U1.164 20.58,37.27 19.79,37.27 19.5,37.57 v18.44,37.57
  Bottom 0.254: v18.44,37.57 15.88,40.13 15.88,48.28 12.88,51.28 J8.4
RWS  (via drill 0.35)
  Top 0.254: U1.166 20.61,36.14 19.83,36.14 19.73,36.04 18.41,36.04 v18.31,36.14
  Bottom 0.254: J8.5 12.88,48.74 15.47,46.15 15.47,38.99 v18.31,36.14
SCLK  (via drill 0.35)
  Top 0.203: 44.23,51.71 44.01,51.93 U2.15
  Top 0.254: 44.23,50.34 44.23,51.71
  Top 0.305: v44.15,50.09 44.15,50.25 44.23,50.34
  Bottom 0.305: J7.5 19.91,57.54 18.67,56.29 18.67,55.26 19.4,54.53 20.51,54.53 26.88,48.16 43.18,48.16 44.2,49.17 44.15,49.22 v44.15,50.09
TIP
  Top 0.254: J1.TIP 35.19,49.49 C7.1
TSCK  (via drill 0.35)
  Top 0.254: v19.18,38.38 19.68,38.38 19.79,38.27 20.58,38.27 U1.162
  Bottom 0.254: v19.18,38.38 18.84,38.71 18.35,38.71 16.28,40.78 16.28,50.42 12.88,53.82 J8.3
TSD  (via drill 0.35)
  Top 0.254: v19.33,40.06 19.46,40.19 U1.158
  Bottom 0.254: v19.33,40.06 17.27,42.11 17.27,54.51 12.88,58.9 J8.1
TWS  (via drill 0.35)
  Top 0.254: v18.62,39.37 19.7,39.37 19.79,39.27 20.58,39.27 U1.160
  Bottom 0.254: v18.62,39.37 16.87,41.12 16.87,52.58 12.95,56.49 J8.2
VCC
  Top 0.254: 11.87,29.43 U3.3
  Top 0.508: 11.87,29.43 C11.1 10.74,32.4 | U$1.3 11.63,40.91 C15.1 10.83,42.04 6.04,42.04 3.56,39.55
  Top 0.61: 3.56,39.55 3.56,33.22 | 3.56,33.22 3.56,19.38 J3.2 | 3.56,33.22 4.38,32.4 10.74,32.4

### Text on the board
tNames: Reed Taylor / Andrew Thompson | GND | TSD | SCLK | 3.3V | TWS | LRCLK | U2 | CE | TSCK | DIN | RSD | MOSI | MCLK | MISO | RWS | DOUT | Anna Lee / Brent Morada | CLK | RSCK | CSN | U$2 | CLOUD CONTROL